# Altium schematic sheet Touch Sensor Address.SchDoc
size A
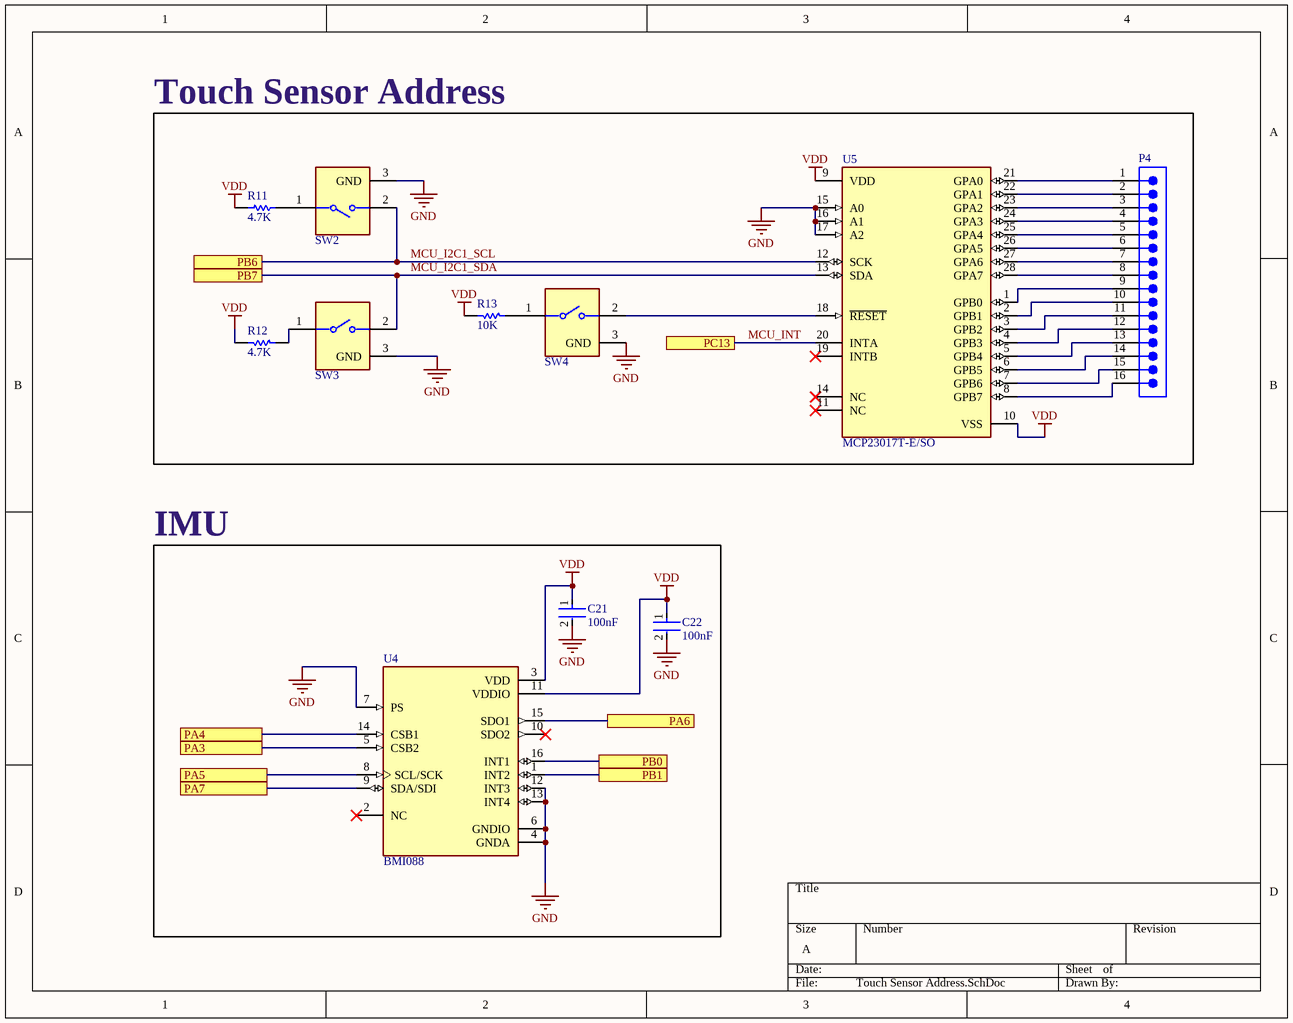
[diagram p0: Touch Sensor Address.SchDoc]

## Parts
C21  100nF  [FP-CL93-IPC_C]
C22  100nF  [FP-CL93-IPC_C]
P4  61301611121  [61301611121]  (value not drawn)
R11  4.7K  [RESC1608X55X25LL10T15]
R12  4.7K  [RESC1608X55X25LL10T15]
R13  10K  [RESC1608X55X25ML10T15]
SW2  B3U-1100PM  [FP-B3U-1100PM-MFG]  (value not drawn)
SW3  B3U-1100PM  [FP-B3U-1100PM-MFG]  (value not drawn)
SW4  B3U-1100PM  [FP-B3U-1100PM-MFG]  (value not drawn)
U4  BMI088  [PQFN50P450X300X100-16N]
U5  MCP23017T-E/SO  [FP-C04-052-MFG]

## Blocks framed on the sheet
Touch Sensor Address: P4 R11-R13 SW2-SW4 U5
IMU: C21 C22 U4

## Ports
PA3 (see STM32F407VGT6TR 100P MCU[2B]), PA4 (see STM32F407VGT6TR 100P MCU[2B]), PA5 (see STM32F407VGT6TR 100P MCU[2B]), PA6 (see STM32F407VGT6TR 100P MCU[2B]), PA7 (see STM32F407VGT6TR 100P MCU[2B]), PB0 (see STM32F407VGT6TR 100P MCU[4A]), PB1 (see STM32F407VGT6TR 100P MCU[4A]), PB6 (see STM32F407VGT6TR 100P MCU[4B]), PB7 (see STM32F407VGT6TR 100P MCU[4B]), PC13 (see STM32F407VGT6TR 100P MCU[2C])

## Nets
GND: C21.2 C22.2 SW2.3(GND) SW3.3(GND) SW4.3(GND) U4.4(GNDA) U4.6(GNDIO) U4.7(PS) U4.12(INT3) U4.13(INT4) U5.15(A0) U5.16(A1) U5.17(A2)
VDD: C21.1 C22.1 R11.1 R12.1 R13.1 U4.3(VDD) U4.11(VDDIO) U5.9(VDD) U5.10(VSS)
MCU_I2C1_SCL: SW2.2 U5.12(SCK) ; port PB6
MCU_I2C1_SDA: SW3.2 U5.13(SDA) ; port PB7
MCU_INT: U5.20(INTA) ; port PC13
PA3: U4.5(CSB2) ; port PA3
PA4: U4.14(CSB1) ; port PA4
PA5: U4.8(SCL/SCK) ; port PA5
PA6: U4.15(SDO1) ; port PA6
PA7: U4.9(SDA/SDI) ; port PA7
PB0: U4.16(INT1) ; port PB0
PB1: U4.1(INT2) ; port PB1
NetP4_1: P4.1 U5.21(GPA0)
NetP4_2: P4.2 U5.22(GPA1)
NetP4_3: P4.3 U5.23(GPA2)
NetP4_4: P4.4 U5.24(GPA3)
NetP4_5: P4.5 U5.25(GPA4)
NetP4_6: P4.6 U5.26(GPA5)
NetP4_7: P4.7 U5.27(GPA6)
NetP4_8: P4.8 U5.28(GPA7)
NetP4_9: P4.9 U5.1(GPB0)
NetP4_10: P4.10 U5.2(GPB1)
NetP4_11: P4.11 U5.3(GPB2)
NetP4_12: P4.12 U5.4(GPB3)
NetP4_13: P4.13 U5.5(GPB4)
NetP4_14: P4.14 U5.6(GPB5)
NetP4_15: P4.15 U5.7(GPB6)
NetP4_16: P4.16 U5.8(GPB7)
NetR11_2: R11.2 SW2.1
NetR12_2: R12.2 SW3.1
NetR13_2: R13.2 SW4.1
NetSW4_2: SW4.2 U5.18(~{RESET})

Not connected (* = marked no-connect by the designer): U4 2(NC)* 10(SDO2)*; U5 11(NC)* 14(NC)* 19(INTB)*

## Library data of the parts
C21 C22 = CMP-13271-000610-1: Cap Ceramic 100nF 10V X7R ±10% SMD 0402 +125°C Paper T/R
P4 = CMP-1502-01095-4: NexarPartId: 32855548; Voltage Rating: 250V; Connector Type: Male Pin; Current Rating: 3A; Contact Resistance: 20mΩ; Number of Contacts: 16; Gender: Male; Pitch: 2.54mm; Min Operating Temperature: -40°C; Termination: Solder; Height: 8.89mm; Contact Plating: Gold; Packaging: Bulk; Contact Material: Copper; Mount: Through Hole; Number of Rows: 1; Contact Mating Length: 5.9944mm; Operating Supply Voltage: 250V; RoHS: Compliant; Max Operating Temperature: 105°C; Lead Pitch: 2.54mm; Color: Black; Number of Pins: 16; Number of Positions: 16; REACH SVHC: Unknown; Orientation: Vertical
R11 R12 = CMP-2000-06942-1: Chip Resistor, 4.7 KOhm, +/- 1%, 0.1 W, -55 to 155 degC, 0603 (1608 Metric), RoHS, Tape and Reel; Manufacturer: Yageo; Power Rating: 100mW; Temperature Coefficient: 100PPM/C; Resistance: 4.7kOhms; Voltage Rating: 50V; Package Reference: 0603; Series: RC; Datasheet Version: Rev. 7, 05/2017; Packaging: Reel; Termination Style: SMD/SMT; Datasheet URL: http://www.yageo.com/documents/recent/PYu-RC_Group_51_RoHS_L_7.pdf; Manufacturer URL: http://www.yageo.com/; Package Description: 2-Pin Surface Mount Device, Body 1.6 x 0.8 mm; Case Code - mm: 1608; Case Code - in: 0603; Mounting Technology: SurfaceMount; Operating Temperature Range: -55Cto+155C; Tolerance: 1%; Product: ThickFilmResistorsGeneralPurpose
R13 = CMP-2000-05022-1: Resistor, 10 KOhm, +/- 5%, 100 mW, -55 to 155 degC, 0603 (1608 Metric), RoHS, Tape and Reel; Manufacturer: Yageo; Resistance: 10kOhms; Voltage Rating: 50V; Temperature Coefficient: 100PPM/C; Power Rating: 100mW; Package Reference: 603; Series: RC; Case Code - mm: 1608; Packaging: Reel; Datasheet URL: http://www.farnell.com/datasheets/443971.pdf; Datasheet Version: Rev. 4, 04/2009; Operating Temperature Range: -55Cto+155C; Product: ThickFilmResistorsGeneralPurpose; Package Description: 2-Pin Surface Mount Device, Body 1.6 x 0.8 mm; Manufacturer URL: http://www.yageo.com/; Case Code - in: 0603; Tolerance: 5%; Termination Style: SMD/SMT
SW2-SW4 = CMP-08834-000028-1: SWITCH TACTILE SPST-NO 0.05A 12V; Switch Travel: 0.15mm; Throw Configuration: SPST; Current Rating: 50mA; Illumination Type: Non-Illuminated; Actuator Length: 0.4mm; Operating Force: 1.5N; Connector Type: SMD/SMT; Contact Resistance: 100mR; Actuator Type: Standard; Electrical Life: 200000Cycles; Switch Function: Off-Mom; Ratings: Dust Proof; Max Operating Temperature: 70°C; Weight: 0.022g; Series: B3U; Min Operating Temperature: -25°C; Voltage Rating (DC): 12V; Orientation: Straight; Package Quantity: 1000; Packaging: Tape and Reel; RoHS Compliant: Yes; REACH SVHC: No SVHC; Max Voltage Rating (DC): 12V; Mount: Surface Mount; Case/Package: SMD/SMT; Mechanical Life: 200000Cycles; Termination: SMD/SMT
U4 = BMI088: High-performance 6-axis inertial sensor (accelerometer + gyroscope) <a href="https://pricing.snapeda.com/parts/BMI088/Bosch%20Sensortec/view-part?ref=eda">Check prices</a>; Package: None; MP: BMI088; Value: *; Availability: Unavailable; Price: None
U5 = CMP-0186-00060-3: IC I/O EXPANDER I2C 16B 28SOIC; Number of Channels: 1; Operating Supply Voltage: 5.5V; Max Frequency: 1.7MHz; Nominal Supply Current: 1mA; Number of Bits: 16; Interface: I2C; Number of Pins: 28; Max Operating Temperature: 125°C; Packaging: Tape and Reel; Case/Package: SOIC; Package Quantity: 1600; Min Operating Temperature: -40°C; Lead Free: Lead Free; Frequency: 1.7MHz; Number of I/Os: 16